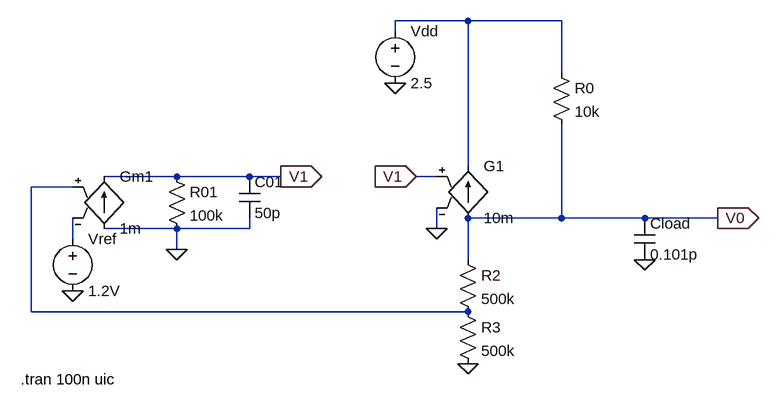
[diagram p0: schematic linregtrans.asc]
linregtrans.asc, the LTspice schematic file:
Version 4
SHEET 1 880 680
WIRE 144 -144 32 -144
WIRE 288 -144 144 -144
WIRE 32 -128 32 -144
WIRE 288 -64 288 -144
WIRE 144 80 144 -144
WIRE -304 96 -416 96
WIRE -192 96 -304 96
WIRE -144 96 -192 96
WIRE 96 96 64 96
WIRE -464 112 -528 112
WIRE 288 160 288 16
WIRE 288 160 144 160
WIRE 416 160 288 160
WIRE 528 160 416 160
WIRE -304 176 -416 176
WIRE -192 176 -192 160
WIRE -192 176 -304 176
WIRE 96 176 96 144
WIRE -464 192 -464 160
WIRE -304 208 -304 176
WIRE 144 224 144 160
WIRE -528 304 -528 112
WIRE 144 304 -528 304
FLAG -144 96 V1
IOPIN -144 96 Out
FLAG 64 96 V1
IOPIN 64 96 In
FLAG 96 176 0
FLAG 144 384 0
FLAG 416 224 0
FLAG 528 160 V0
IOPIN 528 160 Out
FLAG 32 -48 0
FLAG -304 208 0
FLAG -464 272 0
SYMBOL g -416 80 R0
SYMATTR InstName Gm1
SYMATTR Value 1m
SYMBOL res -320 80 R0
SYMATTR InstName R01
SYMATTR Value 100k
SYMBOL cap -208 96 R0
SYMATTR InstName C01
SYMATTR Value 50p
SYMBOL g 144 64 R0
SYMATTR InstName G1
SYMATTR Value 10m
SYMBOL res 272 -80 R0
SYMATTR InstName R0
SYMATTR Value 10k
SYMBOL res 128 208 R0
SYMATTR InstName R2
SYMATTR Value 500k
SYMBOL res 128 288 R0
SYMATTR InstName R3
SYMATTR Value 500k
SYMBOL cap 400 160 R0
SYMATTR InstName Cload
SYMATTR Value 0.101p
SYMBOL voltage -464 176 R0
SYMATTR InstName Vref
SYMATTR Value 1.2V
SYMBOL voltage 32 -144 R0
SYMATTR InstName Vdd
SYMATTR Value 2.5
TEXT -544 408 Left 2 !.tran 100n uic

The netlist it stands for:
* linregtrans.asc
Gm1 0 V1 N002 N003 1m
R01 V1 0 100k
C01 V1 0 50p
G1 V0 N001 V1 0 10m
R0 N001 V0 10k
R2 V0 N002 500k
R3 N002 0 500k
Cload V0 0 0.101p
Vref N003 0 1.2V
Vdd N001 0 2.5
.tran 100n uic
.backanno
.end